# Altium schematic sheet Input_Trafo.SchDoc
size A4; SheetNumber: 3; SheetTotal: 3
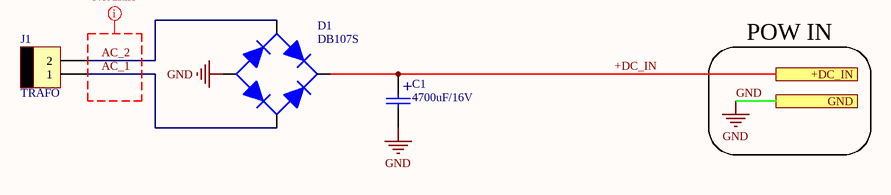
[diagram p0: Input_Trafo.SchDoc]

## Parts
C1  4700uF/16V  [CAP300RP]
D1  DB107S  [DBS]
J1  TRAFO  [MOLEX-2]

## Ports
+DC_IN (see WaterLevelControl-v1.0_top[2B]), GND (see WaterLevelControl-v1.0_top[2B], DCDC_Buck_1A[1B])

## Nets
GND: C1.2 D1.4(-) ; port GND
+DC_IN: C1.1 D1.2(+) ; port +DC_IN
AC_1: D1.3(AC-) J1.1
AC_2: D1.1(AC+) J1.2

## Layout directives
net class AC_IN: AC_1, AC_2

## Notes on the sheet
- POW IN
- (in symbol CAPPOL-THT) +

## Library data of the parts
C1 = CAPPOL-THT
D1 = DB107S: Bridge Rectifier Single Phase Standard 1000 V Surface Mount 4-MiniDIP; JLCPart: C5377
J1 = MOLEX-2